# Altium project Motor_Driver_HIP4082_Board_V1.3.PrjPcb
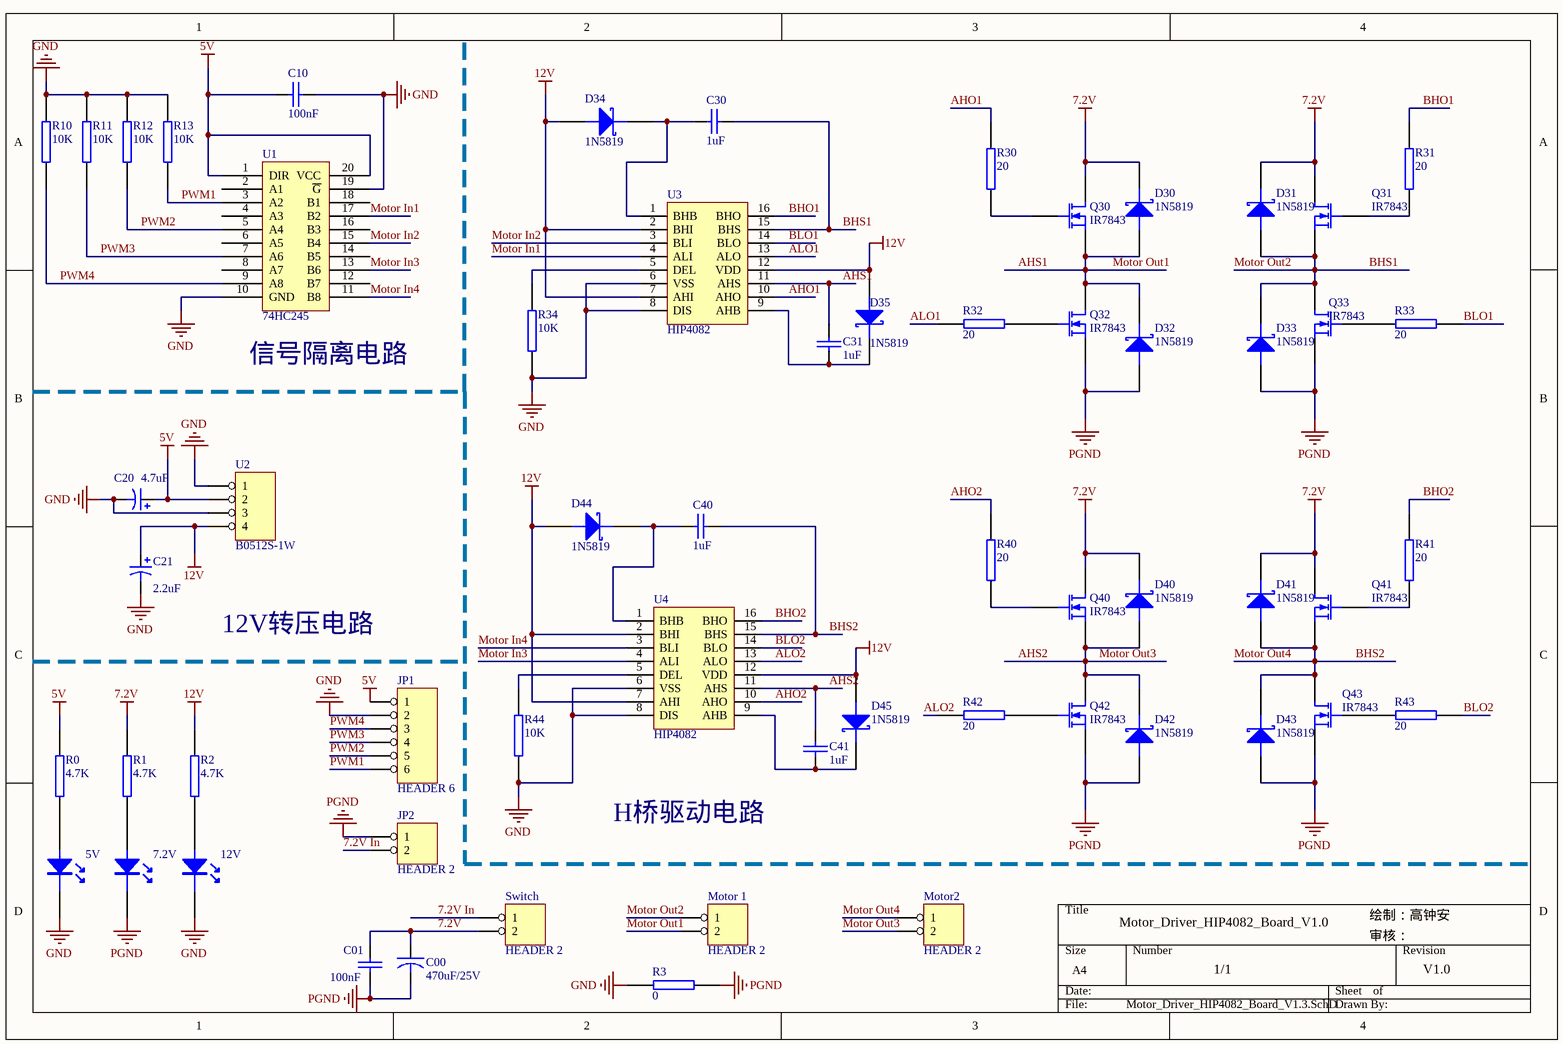
[diagram p0: Motor_Driver_HIP4082_Board_V1.3.SchDoc]
1 sheet, 59 parts. Net scope: global (net labels, ports and power ports of the same name join across sheets).
Board file: Motor_Driver_HIP4082_Board_V1.3.PcbDoc

## Sheet Motor_Driver_HIP4082_Board_V1.3.SchDoc
size A4

### Parts
5V  (no value)  [0805_LED_S1]
7.2V  (no value)  [0805_LED_S1]
12V  (no value)  [0805_LED_S1]
C00  470uF/25V  [RB.2/.4]
C01  100nF  [0805C]
C10  100nF  [0603_C]
C20  value 4.7uF  [3528]
C21  value 2.2uF  [3528]
C30  1uF  [0603C]
C31  1uF  [0603C]
C40  1uF  [0603_C]
C41  1uF  [0603_C]
D30  1N5819  [SOD-323]
D31  1N5819  [SOD-323]
D32  1N5819  [SOD-323]
D33  1N5819  [SOD-323]
D34  1N5819  [SOD-323]
D35  1N5819  [SOD-323]
D40  1N5819  [SOD-323]
D41  1N5819  [SOD-323]
D42  1N5819  [SOD-323]
D43  1N5819  [SOD-323]
D44  1N5819  [SOD-323]
D45  1N5819  [SOD-323]
JP1  HEADER 6  [SIP6N]
JP2  HEADER 2  [KF301-2P]
Motor2  HEADER 2  [KF301-2P]
Motor_1  HEADER 2  [KF301-2P]
Q30  IR7843  [LR7843]
Q31  IR7843  [LR7843]
Q32  IR7843  [LR7843]
Q33  IR7843  [LR7843]
Q40  IR7843  [LR7843]
Q41  IR7843  [LR7843]
Q42  IR7843  [LR7843]
Q43  IR7843  [LR7843]
R0  4.7K  [0603_R]
R1  4.7K  [0603_R]
R2  4.7K  [0603_R]
R3  0  [0805]
R10  10K  [0603_R]
R11  10K  [0603_R]
R12  10K  [0603_R]
R13  10K  [0603_R]
R30  20  [0805]
R31  20  [0805]
R32  20  [0805]
R33  20  [0805]
R34  10K  [0603_R]
R40  20  [0805]
R41  20  [0805]
R42  20  [0805]
R43  20  [0805]
R44  10K  [0603_R]
Switch  HEADER 2  [SWITCH-MINI]
U1  74HC245  [SOP20]
U2  B0512S-1W  [SIP4_B_S-1W]
U3  HIP4082  [SOP-16_208mil]
U4  HIP4082  [SOP-16_208mil]

### Nets
5V: C10.1 C20.1 JP1.1 R0.2 U1.1(DIR) U1.20(VCC) U2.2
7.2V: C00.1 C01.2 D30.2(K) D31.2(K) D40.2(K) D41.2(K) Q30.1(D) Q31.1(D) Q40.1(D) Q41.1(D) R1.2 Switch.2
12V: C21.1 D34.1(A) D35.1(A) D44.1(A) D45.1(A) R2.2 U2.4 U3.2(BHI) U3.7(AHI) U3.12(VDD) U4.2(BHI) U4.7(AHI) U4.12(VDD)
GND: 5V.K 12V.K C10.2 C20.2 C21.2 JP1.2 R3.2 R10.2 R11.1 R12.2 R13.2 R34.1 R44.1 U1.10(GND) U1.19(~{G}) U2.1 U2.3 U3.6(VSS) U3.8(DIS) U4.6(VSS) U4.8(DIS)
PGND: 7.2V.K C00.2 C01.1 D32.1(A) D33.1(A) D42.1(A) D43.1(A) JP2.1 Q32.3(S) Q33.3(S) Q42.3(S) Q43.3(S) R3.1
7.2V In: JP2.2 Switch.1
AHO1: R30.2 U3.10(AHO)
AHO2: R40.2 U4.10(AHO)
AHS1: C31.2 D30.1(A) D32.2(K) Motor_1.2 Q30.3(S) Q32.1(D) U3.11(AHS)  [also labelled Motor Out1]
AHS2: C41.2 D40.1(A) D42.2(K) Motor2.2 Q40.3(S) Q42.1(D) U4.11(AHS)  [also labelled Motor Out3]
ALO1: R32.2 U3.13(ALO)
ALO2: R42.2 U4.13(ALO)
BHO1: R31.2 U3.16(BHO)
BHO2: R41.2 U4.16(BHO)
BHS1: C30.2 D31.1(A) D33.2(K) Motor_1.1 Q31.3(S) Q33.1(D) U3.15(BHS)  [also labelled Motor Out2]
BHS2: C40.2 D41.1(A) D43.2(K) Motor2.1 Q41.3(S) Q43.1(D) U4.15(BHS)  [also labelled Motor Out4]
BLO1: R33.1 U3.14(BLO)
BLO2: R43.1 U4.14(BLO)
Motor In1: U1.17(B2) U3.4(ALI)
Motor In2: U1.15(B4) U3.3(BLI)
Motor In3: U1.13(B6) U4.4(ALI)
Motor In4: U1.11(B8) U4.3(BLI)
PWM1: JP1.6 R13.1 U1.3(A2)
PWM2: JP1.5 R12.1 U1.5(A4)
PWM3: JP1.4 R11.2 U1.7(A6)
PWM4: JP1.3 R10.1 U1.9(A8)
Net5V_A: 5V.A R0.1
Net7.2V_A: 7.2V.A R1.1
Net12V_A: 12V.A R2.1
NetC30_1: C30.1 D34.2(K) U3.1(BHB)
NetC31_1: C31.1 D35.2(K) U3.9(AHB)
NetC40_1: C40.1 D44.2(K) U4.1(BHB)
NetC41_1: C41.1 D45.2(K) U4.9(AHB)
NetQ30_2: Q30.2(G) R30.1
NetQ31_2: Q31.2(G) R31.1
NetQ32_2: Q32.2(G) R32.1
NetQ33_2: Q33.2(G) R33.2
NetQ40_2: Q40.2(G) R40.1
NetQ41_2: Q41.2(G) R41.1
NetQ42_2: Q42.2(G) R42.1
NetQ43_2: Q43.2(G) R43.2
NetR34_2: R34.2 U3.5(DEL)
NetR44_2: R44.2 U4.5(DEL)

Not connected (* = marked no-connect by the designer): U1 2(A1) 4(A3) 6(A5) 8(A7) 12(B7) 14(B5) 16(B3) 18(B1)

### Notes on the sheet
- 信号隔离电路
- 12V转压电路
- H桥驱动电路
- Motor_Driver_HIP4082_Board_V1.0
- 绘制：高钟安
- 1/1
- 审核：
- V1.0

### Library data of the parts
5V 7.2V 12V = LED
C00 = CAPACITOR
C01 C10 C30 C31 C40 C41 = CAP: Capacitor
C20 C21 = Cap Pol3: Polarized Capacitor (Surface Mount); Published: 8-Jun-2000; LatestRevisionDate: 29-May-2009; LatestRevisionNote: IPC-7351 Footprint Added.; PackageReference: C0805; Publisher: Altium Limited; PackageDescription: Chip Capacitor
D30-D35 D40-D45 = DIODE SCHOTTKY: Schottky Diode
Q30-Q33 Q40-Q43 = MOSFET-N: N-Channel MOSFET; Published: 8-Jun-2000; LatestRevisionDate: 17-Jul-2002; LatestRevisionNote: Re-released for DXP Platform.; PackageVersion: 1995/1996; PackageReference: E3; Publisher: Altium Limited; PackageDescription: TO, Flat Index; 3 In-Line, Axial Leads; Body Dia. 4.6mm; Lead Dia. 0.5 mm (max)
R0-R3 R10-R13 R30-R34 R40-R44 = RES2
U2 = 4 HEADER: 4 Pin Header